# EAGLE design RotaryEncoder1 (EAGLE 9.6.2)
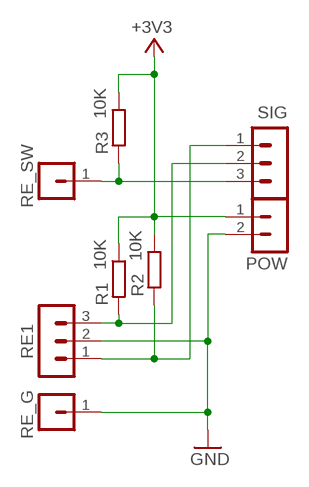
[diagram p0: schematic, sheet 1]

## Parts
POW  PINHEAD-MA02-1  [PINHEAD-MA02-1]
R1  10K  R-EU_0204/5  [0204/5]
R2  10K  R-EU_0204/5  [0204/5]
R3  10K  R-EU_0204/5  [0204/5]
RE1  PINHEAD-MA03-1  [PINHEAD-MA03-1]
RE_G  PINHEAD-MA01-1  [PINHEAD-MA01-1]
RE_SW  PINHEAD-MA01-1  [PINHEAD-MA01-1]
SIG  PINHEAD-MA03-1  [PINHEAD-MA03-1]

## Nets
+3V3: POW.1 R1.1 R2.2 R3.1
GND: POW.2 RE1.2 RE_G.1
N$1: R3.2 RE_SW.1 SIG.3
N$2: R1.2 RE1.3 SIG.2
N$4: R2.1 RE1.1 SIG.1

## Library data of the parts
POW = ytani1:PINHEAD-MA02-1: PIN HEADER
R1-R3 = rcl:R-EU_: RESISTOR, European symbol; SPICEPREFIX: R
RE1 SIG = ytani1:PINHEAD-MA03-1: PIN HEADER; OC_FARNELL: unknown; OC_NEWARK: unknown
RE_G RE_SW = ytani1:PINHEAD-MA01-1

## Board
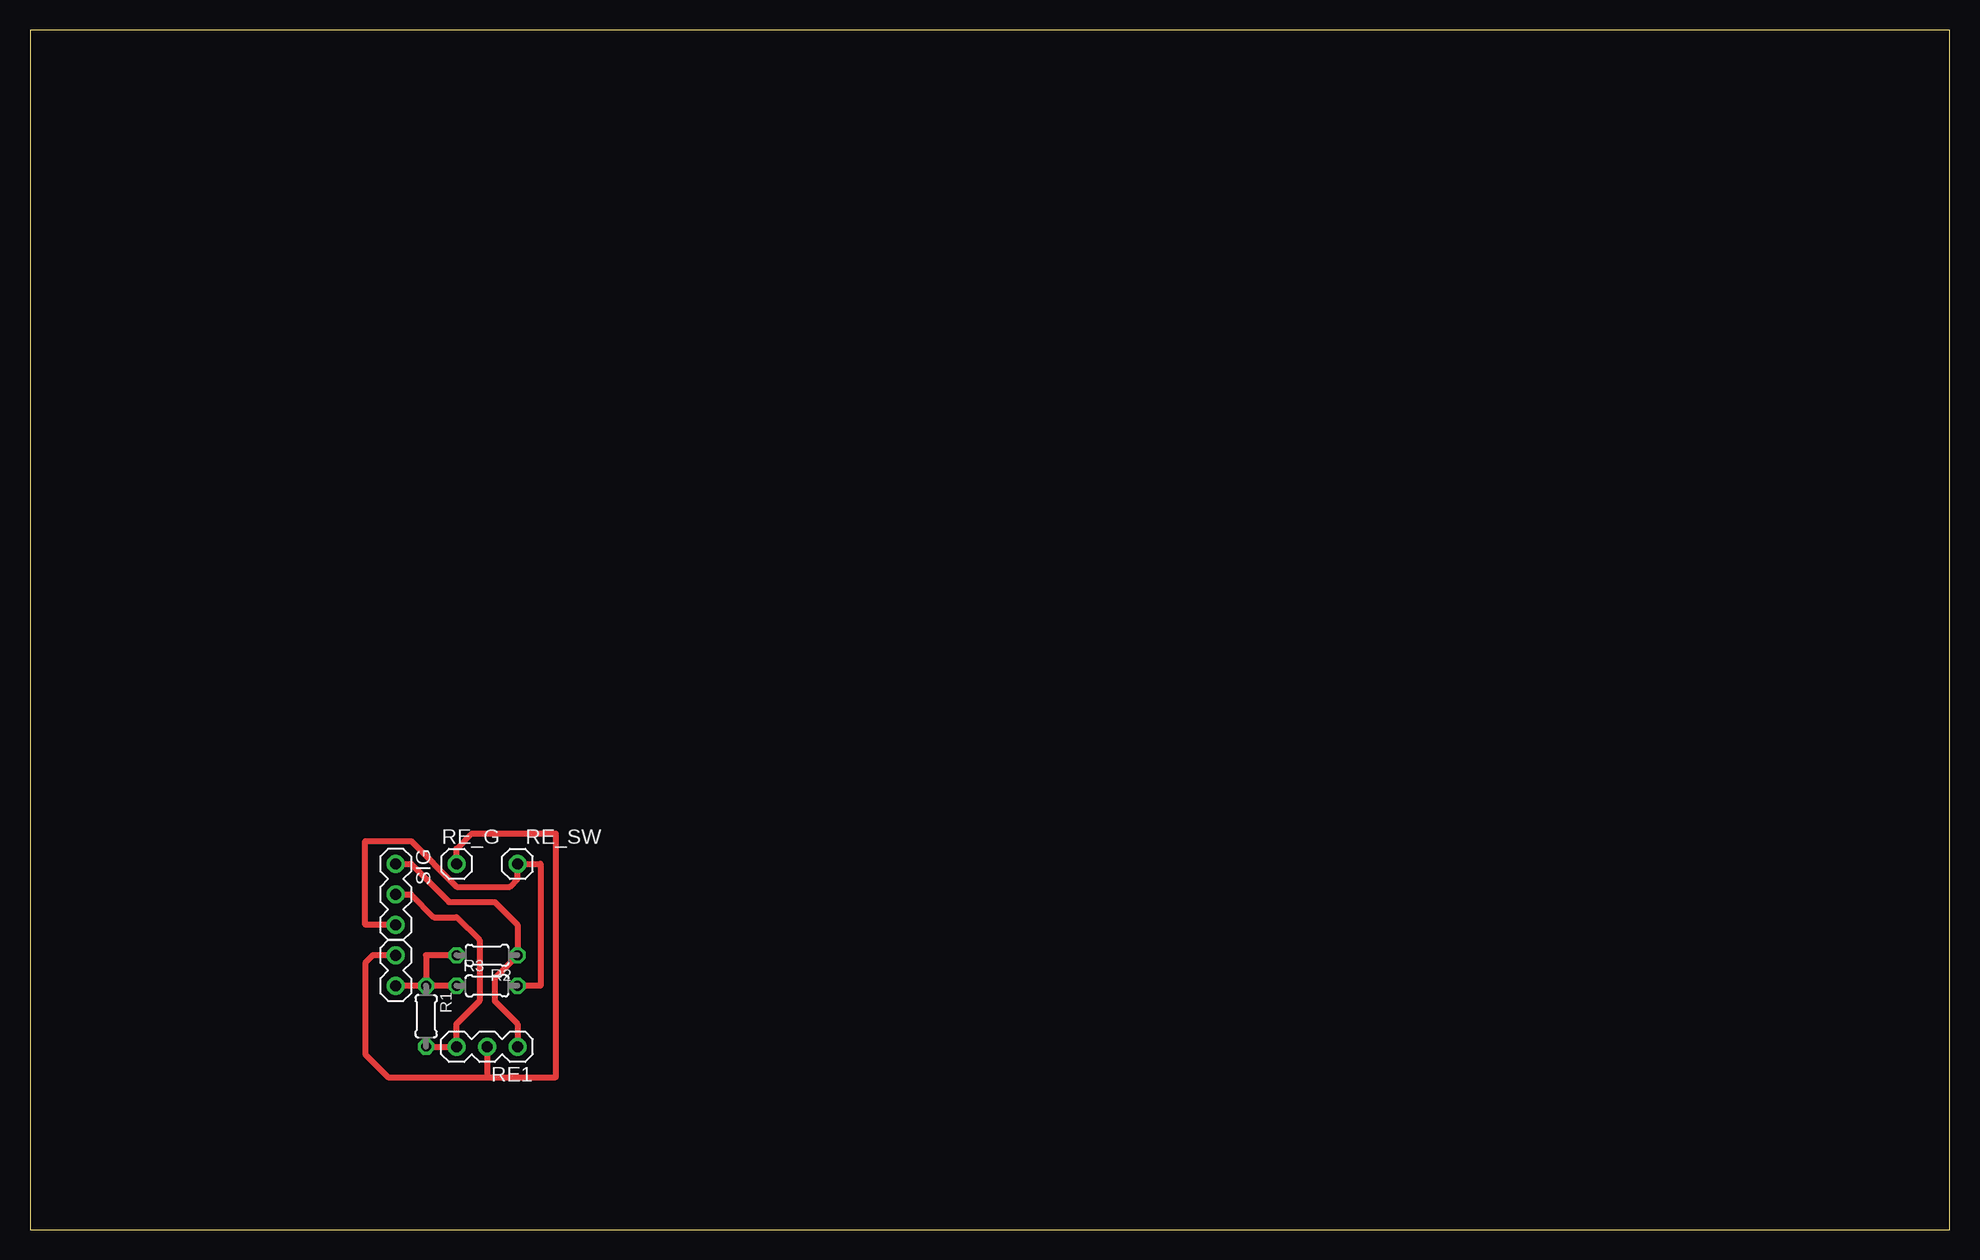
[diagram p1: board, top side]

Size 160 x 100 mm. Coordinates in mm from the lower left corner, seen from the top.
Outline: 0,0 160,0 160,100 0,100 0,0
Copper layers (1*16): Top 0.035mm / dielectric 1.5mm / Bottom 0.035mm
Design rules "default": minimum track width 6mil, minimum drill 0.35mm, track to track 6mil, track to pad 6mil, pad to pad 6mil, via to via 6mil, smd to smd 6mil, copper to edge 40mil, drill to drill 6mil, minimum pad ring 10mil, minimum via ring 8mil, stop-mask expansion 4mil, vias tented up to drill 0mil, thermal gap 10mil

### Footprints (pad centres in the part's own frame; a part is rotated, then mirrored left to right if it is on the bottom)
PINHEAD-MA02-1 = drill 0.9 pad 1.5: 1 -1.27,0; 2 1.27,0
0204/5 = drill 0.813 octagon: 1 -2.54,0; 2 2.54,0
PINHEAD-MA03-1 = drill 0.9 pad 1.5: 1 -1.27,0; 2 1.27,0; 3 3.81,0
PINHEAD-MA01-1 = drill 0.9 pad 1.5: 1 1.27,0

### Placement (x,y rotation side)
POW  30.48,21.59 90 top
R1  33.02,17.78 270 top
R2  38.1,22.86 180 top
R3  38.1,20.32 0 top
RE1  39.37,15.24 180 top
RE_G  34.29,30.48 0 top
RE_SW  41.91,30.48 180 top
SIG  30.48,29.21 270 top

### Tracks (layer width: path | path; a pad name or v marks a point on that pad's centre or on a via)
+3V3
  Top 0.508: R1.1 POW.1 | R3.1 R1.1 | R2.2 33.02,22.86 R1.1
GND
  Top 0.508: RE_G.1 35.56,31.75 36.83,33.02 43.81,33.02 43.81,12.7 38.1,12.7 | 38.1,12.7 29.84,12.7 27.94,14.61 27.94,22.23 28.57,22.86 POW.2 | RE1.2 38.1,12.7
N$1
  Top 0.508: R3.2 42.55,20.32 42.55,30.48 RE_SW.1 40.64,29.21 40.01,28.57 35.56,28.57 31.75,32.38 27.94,32.38 27.94,25.4 SIG.3
N$2
  Top 0.508: R1.2 RE1.3 35.56,17.14 37.47,19.05 37.47,24.13 35.56,26.04 33.66,26.04 31.75,27.94 SIG.2
N$4
  Top 0.508: RE1.1 40.64,17.14 38.73,19.05 38.73,20.95 R2.1 40.64,25.4 38.73,27.3 34.92,27.3 31.75,30.48 SIG.1